# EAGLE board zx81 SD_12 (smd) (EAGLE 9.6.2), part 1 of 3
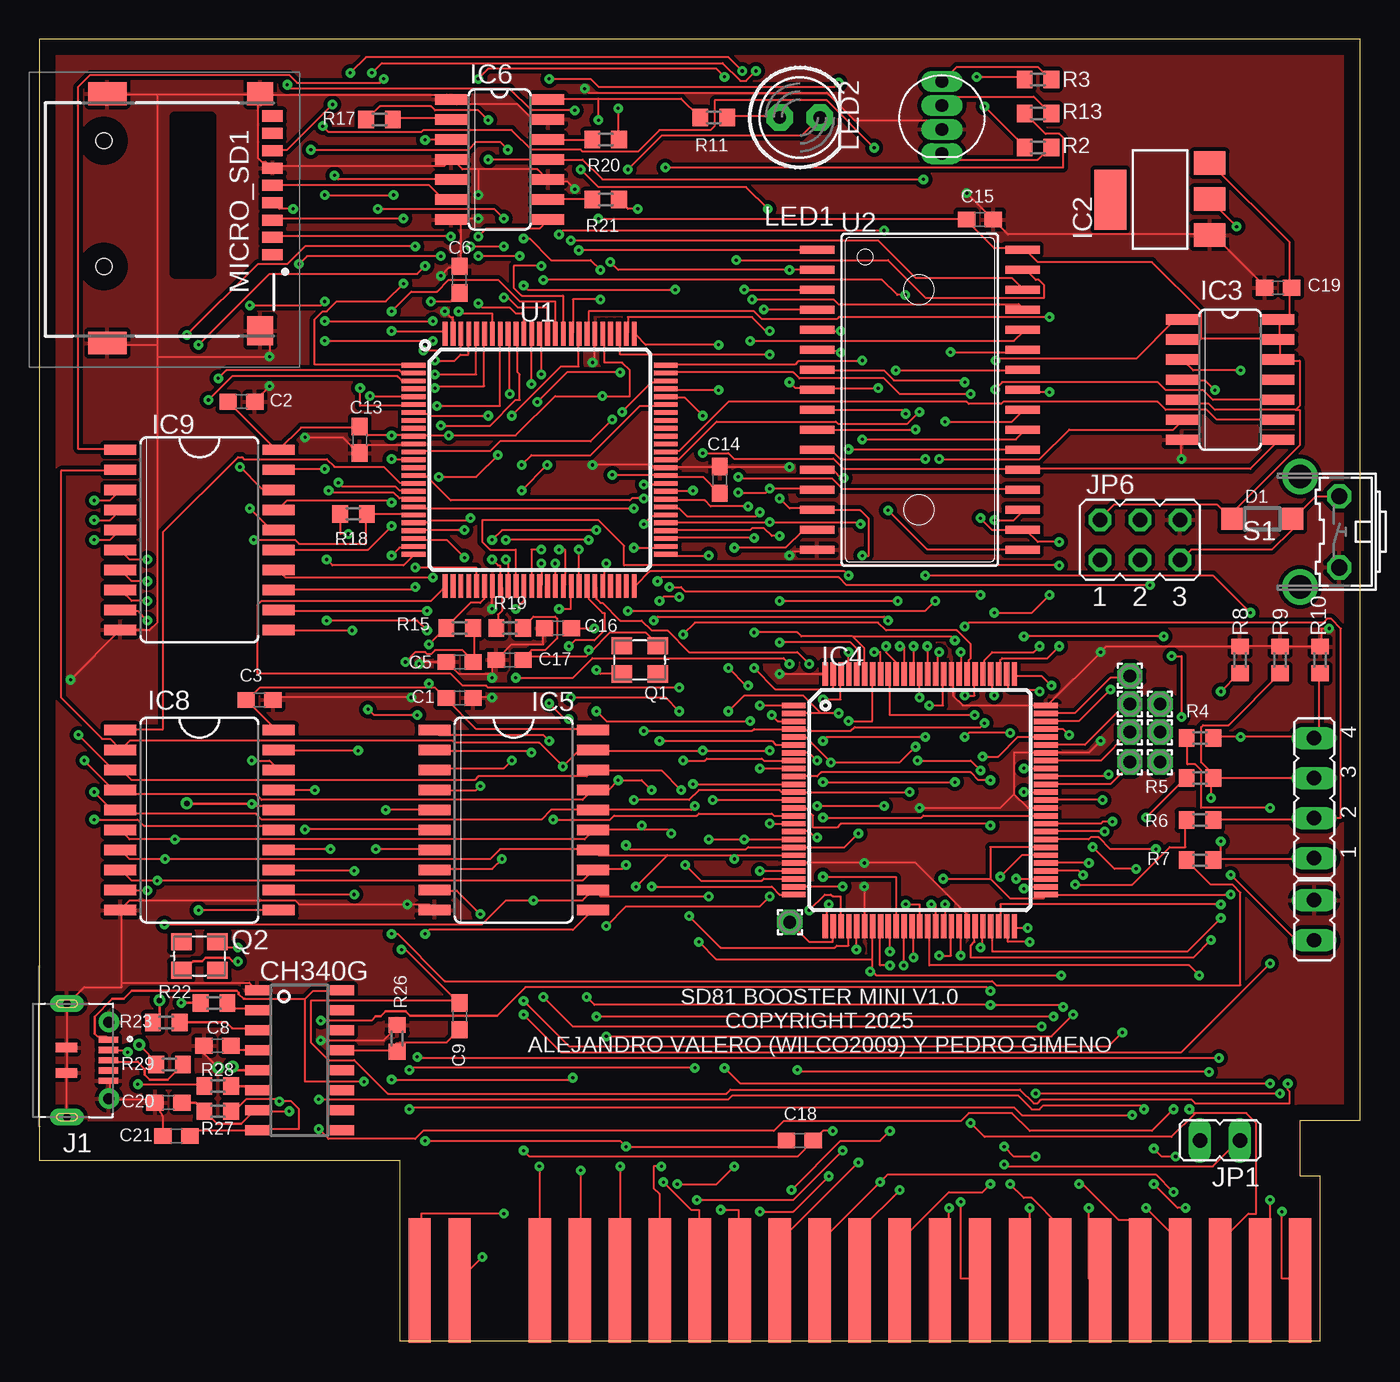
[diagram p3: board, top side]
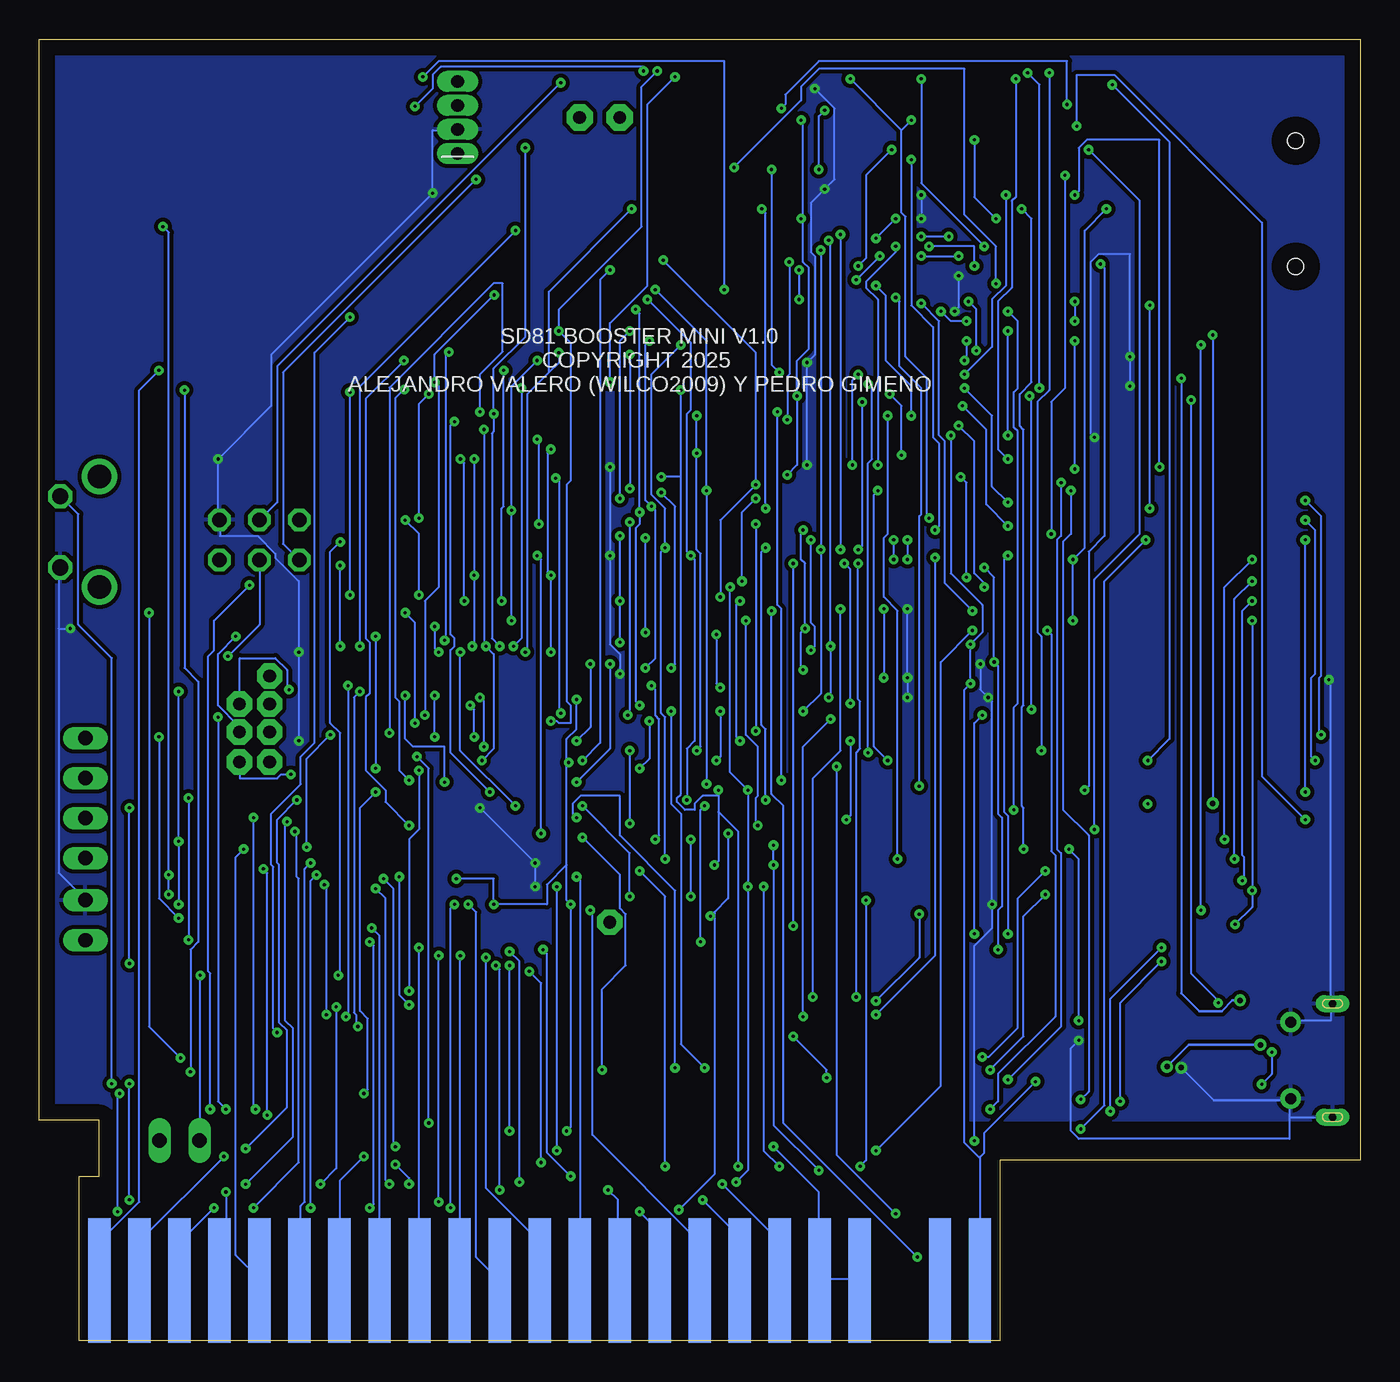
[diagram p4: board, bottom side, seen from below]

Size 83.82 x 82.55 mm. Coordinates in mm from the lower left corner, seen from the top.
Outline: 22.86,0 81.28,0 81.28,10.41 80.01,10.41 80.01,13.97 83.82,13.97 83.82,82.55 0,82.55 0,11.43 22.86,11.43 22.86,0
Copper layers (1*16): Top 0.035mm / dielectric 1.5mm / Bottom 0.035mm
Design rules "default *": minimum track width 5mil, minimum drill 0.2mm, track to track 6mil, track to pad 6mil, pad to pad 6mil, via to via 6mil, smd to smd 6mil, copper to edge 40mil, drill to drill 6mil, minimum pad ring 10mil, minimum via ring 8mil, stop-mask expansion 4mil, vias tented up to drill 999mil, thermal gap 10mil

## Footprints (pad centres in the part's own frame; a part is rotated, then mirrored left to right if it is on the bottom)
EDGEPIN = smd 1.422 x 7.874: 1 0,0
C0603 = smd 1.1 x 1: 1 -0.85,0; 2 0.85,0
SOD123 = smd 1.4 x 1.4: A 1.9,0; C -1.9,0
SOT223 = smd 1.499 x 2.007: 1 -2.261,-3.15; 2 0.025,-3.15; 3 2.311,-3.15 | smd 3.81 x 2.007: 4 0,3.15
SO14 = smd 0.66 x 2.032: 1 -3.81,-3.073; 2 -2.54,-3.073; 3 -1.27,-3.073; 4 0,-3.073; 5 1.27,-3.073; 6 2.54,-3.073; 7 3.81,-3.073; 8 3.81,3.073; 9 2.54,3.073; 10 1.27,3.073; 11 0,3.073; 12 -1.27,3.073; 13 -2.54,3.073; 14 -3.81,3.073
TQFP100 = smd 1.5 x 0.345: 1 -8,6; 2 -8,5.5; 3 -8,5; 4 -8,4.5; 5 -8,4; 6 -8,3.5; 7 -8,3; 8 -8,2.5; 9 -8,2; 10 -8,1.5; 11 -8,1; 12 -8,0.5; 13 -8,0; 14 -8,-0.5; 15 -8,-1; 16 -8,-1.5; 17 -8,-2; 18 -8,-2.5; 19 -8,-3; 20 -8,-3.5; 21 -8,-4; 22 -8,-4.5; 23 -8,-5; 24 -8,-5.5; 25 -8,-6; 51 8,-6; 52 8,-5.5; 53 8,-5; 54 8,-4.5; 55 8,-4; 56 8,-3.5; 57 8,-3; 58 8,-2.5; 59 8,-2; 60 8,-1.5; 61 8,-1; 62 8,-0.5; 63 8,0; 64 8,0.5; 65 8,1; 66 8,1.5; 67 8,2; 68 8,2.5; 69 8,3; 70 8,3.5; 71 8,4; 72 8,4.5; 73 8,5; 74 8,5.5; 75 8,6 | smd 0.345 x 1.5: 26 -6,-8; 27 -5.5,-8; 28 -5,-8; 29 -4.5,-8; 30 -4,-8; 31 -3.5,-8; 32 -3,-8; 33 -2.5,-8; 34 -2,-8; 35 -1.5,-8; 36 -1,-8; 37 -0.5,-8; 38 0,-8; 39 0.5,-8; 40 1,-8; 41 1.5,-8; 42 2,-8; 43 2.5,-8; 44 3,-8; 45 3.5,-8; 46 4,-8; 47 4.5,-8; 48 5,-8; 49 5.5,-8; 50 6,-8; 76 6,8; 77 5.5,8; 78 5,8; 79 4.5,8; 80 4,8; 81 3.5,8; 82 3,8; 83 2.5,8; 84 2,8; 85 1.5,8; 86 1,8; 87 0.5,8; 88 0,8; 89 -0.5,8; 90 -1,8; 91 -1.5,8; 92 -2,8; 93 -2.5,8; 94 -3,8; 95 -3.5,8; 96 -4,8; 97 -4.5,8; 98 -5,8; 99 -5.5,8; 100 -6,8
SO20W = smd 0.66 x 2.032: 1 -5.715,-5.029; 2 -4.445,-5.029; 3 -3.175,-5.029; 4 -1.905,-5.029; 5 -0.635,-5.029; 6 0.635,-5.029; 7 1.905,-5.029; 8 3.175,-5.029; 9 4.445,-5.029; 10 5.715,-5.029; 11 5.715,5.029; 12 4.445,5.029; 13 3.175,5.029; 14 1.905,5.029; 15 0.635,5.029; 16 -0.635,5.029; 17 -1.905,5.029; 18 -3.175,5.029; 19 -4.445,5.029; 20 -5.715,5.029
SOIC16 = smd 0.635 x 1.524: 1 -4.445,-2.695; 2 -3.175,-2.695; 3 -1.905,-2.695; 4 -0.635,-2.695; 5 0.635,-2.695; 6 1.905,-2.695; 7 3.175,-2.695; 8 4.445,-2.695; 9 4.445,2.695; 10 3.175,2.695; 11 1.905,2.695; 12 0.635,2.695; 13 -0.635,2.695; 14 -1.905,2.695; 15 -3.175,2.695; 16 -4.445,2.695
SHOUHAN_MICROXNJ = smd 0.4 x 1.25: 1 1.3,-4.375; 2 0.65,-4.375; 3 0,-4.375; 4 -0.65,-4.375; 5 -1.3,-4.375 | smd 0.6 x 1.35: S1 -0.8,-1.725; S2 0.8,-1.725 | drill 0.5 pad 1.07 long: S3 -3.6,-1.75; S6 3.6,-1.75 | drill 0.7 pad 1.3: S4 -2.425,-4.4; S5 2.425,-4.4
JP1 = drill 0.914 long: 1 0,-1.27; 2 0,1.27
JP4 = drill 0.914 long: 1 -3.81,0; 2 -1.27,0; 3 1.27,0; 4 3.81,0
JP3Q = drill 0.914 octagon: 1 -2.54,-1.27; 2 -2.54,1.27; 3 0,-1.27; 4 0,1.27; 5 2.54,-1.27; 6 2.54,1.27
LED5MM = drill 0.813 pad 1.676 octagon: A -1.27,0; K 1.27,0
LED-RGB-THRU = drill 0.813 long: 1 2.286,0; 2 0.762,0; 3 -0.762,0; 4 -2.286,0
TF-01A = smd 0.7 x 1.3: 1 2.23,7.174; 2 1.13,7.174; 3 0.03,7.174; 4 -1.07,7.174; 5 -2.17,7.174; 6 -3.27,7.174; 7 -4.37,7.174; 8 -5.47,7.174; CD1 -6.57,7.174 | smd 1.448 x 1.651: MP1 -7.989,6.4 | smd 1.448 x 2.438: MP2 -7.989,-3.3; MP3 7.836,-3.3 | smd 1.854 x 1.651: MP4 7.061,6.4 | hole 1: -5.004,-3.531; 2.972,-3.531
1,6/0,8 = drill 0.813 pad 1.6 octagon: 1 0,0
3.2X2.5_KX-7 = smd 1.3 x 1.1: 1 -1.15,-0.9; 2 1.15,-0.9; 3 1.15,0.9; 4 -1.15,0.9
R0603 = smd 1 x 1.1: 1 -0.85,0; 2 0.85,0
B3F-31XX = drill 1.016 octagon: 1 -2.261,-1.245; 2 2.261,-1.245 | drill 1.499 pad 2.159: 3 -3.505,1.245; 4 3.505,1.245
TQFP100' = smd 1.5 x 0.3: 1 -8,6; 2 -8,5.5; 3 -8,5; 4 -8,4.5; 5 -8,4; 6 -8,3.5; 7 -8,3; 8 -8,2.5; 9 -8,2; 10 -8,1.5; 11 -8,1; 12 -8,0.5; 13 -8,0; 14 -8,-0.5; 15 -8,-1; 16 -8,-1.5; 17 -8,-2; 18 -8,-2.5; 19 -8,-3; 20 -8,-3.5; 21 -8,-4; 22 -8,-4.5; 23 -8,-5; 24 -8,-5.5; 25 -8,-6; 51 8,-6; 52 8,-5.5; 53 8,-5; 54 8,-4.5; 55 8,-4; 56 8,-3.5; 57 8,-3; 58 8,-2.5; 59 8,-2; 60 8,-1.5; 61 8,-1; 62 8,-0.5; 63 8,0; 64 8,0.5; 65 8,1; 66 8,1.5; 67 8,2; 68 8,2.5; 69 8,3; 70 8,3.5; 71 8,4; 72 8,4.5; 73 8,5; 74 8,5.5; 75 8,6 | smd 0.3 x 1.5: 26 -6,-8; 27 -5.5,-8; 28 -5,-8; 29 -4.5,-8; 30 -4,-8; 31 -3.5,-8; 32 -3,-8; 33 -2.5,-8; 34 -2,-8; 35 -1.5,-8; 36 -1,-8; 37 -0.5,-8; 38 0,-8; 39 0.5,-8; 40 1,-8; 41 1.5,-8; 42 2,-8; 43 2.5,-8; 44 3,-8; 45 3.5,-8; 46 4,-8; 47 4.5,-8; 48 5,-8; 49 5.5,-8; 50 6,-8; 76 6,8; 77 5.5,8; 78 5,8; 79 4.5,8; 80 4,8; 81 3.5,8; 82 3,8; 83 2.5,8; 84 2,8; 85 1.5,8; 86 1,8; 87 0.5,8; 88 0,8; 89 -0.5,8; 90 -1,8; 91 -1.5,8; 92 -2,8; 93 -2.5,8; 94 -3,8; 95 -3.5,8; 96 -4,8; 97 -4.5,8; 98 -5,8; 99 -5.5,8; 100 -6,8
SOP32-5 = smd 2.2 x 0.5: 1 -6.516,9.525; 2 -6.516,8.255; 3 -6.516,6.985; 4 -6.516,5.715; 5 -6.516,4.445; 6 -6.516,3.175; 7 -6.516,1.905; 8 -6.516,0.635; 9 -6.516,-0.635; 10 -6.516,-1.905; 11 -6.516,-3.175; 12 -6.516,-4.445; 13 -6.516,-5.715; 14 -6.516,-6.985; 15 -6.516,-8.255; 16 -6.516,-9.525; 17 6.516,-9.525; 18 6.516,-8.255; 19 6.516,-6.985; 20 6.516,-5.715; 21 6.516,-4.445; 22 6.516,-3.175; 23 6.516,-1.905; 24 6.516,-0.635; 25 6.516,0.635; 26 6.516,1.905; 27 6.516,3.175; 28 6.516,4.445; 29 6.516,5.715; 30 6.516,6.985; 31 6.516,8.255; 32 6.516,9.525

## Placement (x,y rotation side)
1A  D7  [EDGEPIN]  24.13,3.81 0 top
1B  VCC  [EDGEPIN]  24.13,3.81 180 bottom
2A  /RAMCS  [EDGEPIN]  26.67,3.81 0 top
2B  9V  [EDGEPIN]  26.67,3.81 180 bottom
4A  D0  [EDGEPIN]  31.75,3.81 0 top
4B  GND  [EDGEPIN]  31.75,3.81 180 bottom
5A  D1  [EDGEPIN]  34.29,3.81 0 top
5B  GND  [EDGEPIN]  34.29,3.81 180 bottom
6A  D2  [EDGEPIN]  36.83,3.81 0 top
6B  /CLOCK  [EDGEPIN]  36.83,3.81 180 bottom
7A  D6  [EDGEPIN]  39.37,3.81 0 top
7B  A0  [EDGEPIN]  39.37,3.81 180 bottom
8A  D5  [EDGEPIN]  41.91,3.81 0 top
8B  A1  [EDGEPIN]  41.91,3.81 180 bottom
9A  D3  [EDGEPIN]  44.45,3.81 0 top
9B  A2  [EDGEPIN]  44.45,3.81 180 bottom
10A  D4  [EDGEPIN]  46.99,3.81 0 top
10B  A3  [EDGEPIN]  46.99,3.81 180 bottom
11A  A6  [EDGEPIN]  49.53,3.81 0 top
11B  A15  [EDGEPIN]  49.53,3.81 180 bottom
12A  /NMI  [EDGEPIN]  52.07,3.81 0 top
12B  A14  [EDGEPIN]  52.07,3.81 180 bottom
13A  /HALT  [EDGEPIN]  54.61,3.81 0 top
13B  A13  [EDGEPIN]  54.61,3.81 180 bottom
14A  /MREQ  [EDGEPIN]  57.15,3.81 0 top
14B  A12  [EDGEPIN]  57.15,3.81 180 bottom
15A  /IORQ  [EDGEPIN]  59.69,3.81 0 top
15B  A11  [EDGEPIN]  59.69,3.81 180 bottom
16A  /RD  [EDGEPIN]  62.23,3.81 0 top
16B  A10  [EDGEPIN]  62.23,3.81 180 bottom
17A  /WR  [EDGEPIN]  64.77,3.81 0 top
17B  A9  [EDGEPIN]  64.77,3.81 180 bottom
18A  /BUSAK  [EDGEPIN]  67.31,3.81 0 top
18B  A8  [EDGEPIN]  67.31,3.81 180 bottom
19A  /WAIT  [EDGEPIN]  69.85,3.81 0 top
19B  A7  [EDGEPIN]  69.85,3.81 180 bottom
20A  /BUSRQ  [EDGEPIN]  72.39,3.81 0 top
20B  A6  [EDGEPIN]  72.39,3.81 180 bottom
21A  /RESET  [EDGEPIN]  74.93,3.81 0 top
21B  A5  [EDGEPIN]  74.93,3.81 180 bottom
22A  /M1  [EDGEPIN]  77.47,3.81 0 top
22B  A4  [EDGEPIN]  77.47,3.81 180 bottom
23A  /RFSH  [EDGEPIN]  80.01,3.81 0 top
23B  /ROMCS  [EDGEPIN]  80.01,3.81 180 bottom
C1  100nF  [C0603]  26.67,40.77 0 top
C2  100nF  [C0603]  12.83,59.56 0 top
C3  100nF  [C0603]  13.97,40.64 0 top
C5  22pF  [C0603]  26.67,43.05 0 top
C6  0.1uF  [C0603]  26.67,67.31 90 top
C8  0.1uF  [C0603]  11.3,18.7 0 top
C9  100nF  [C0603]  26.67,20.57 270 top
C13  0.1uF  [C0603]  20.32,57.15 270 top
C14  0.1uF  [C0603]  43.18,54.61 90 top
C15  100nF  [C0603]  59.69,71.12 0 top
C16  22pF  [C0603]  32.91,45.19 0 top
C17  22pF  [C0603]  29.84,43.18 0 top
C18  100nF  [C0603]  48.26,12.7 180 top
C19  100nF  [C0603]  78.61,66.8 180 top
C20  22pF  [C0603]  8.19,15.1 0 top
C21  22pF  [C0603]  8.7,12.97 0 top
D1  [SOD123]  77.61,52.13 0 top
IC2  REG1117  [SOT223]  71.12,72.39 90 top
IC3  74ACT125D  [SO14]  75.56,60.96 270 top
IC4  XC95144XL-10TQG100C  [TQFP100]  55.88,34.29 0 top
IC5  74HC573D  [SO20W]  30.1,33.02 270 top
IC6  74LVC125  [SO14]  29.21,74.93 270 top
IC7  CH340G  [SOIC16]  16.51,17.78 270 top
IC8  74HC573D  [SO20W]  10.16,33.02 270 top
IC9  74HC573D  [SO20W]  10.16,50.8 270 top
J1  MICROXNJ (C404969)  [SHOUHAN_MICROXNJ]  0,17.78 90 top
JP1  MC45  [JP1]  74.93,12.7 90 top
JP2  [JP1]  80.9,26.67 0 top
JP3  JTAG  [JP4]  80.9,34.42 90 top
JP6  ICSP  [JP3Q]  69.85,50.8 0 top
LED1  SD  [LED5MM]  48.26,77.6 0 top
LED2  DIFFUSE  [LED-RGB-THRU]  57.28,77.6 270 top
MICRO_SD1  TF-01A  [TF-01A]  7.62,71.12 270 top
PAD1  [1,6/0,8]  47.62,26.54 0 top
PAD2  [1,6/0,8]  69.22,36.7 0 top
PAD3  [1,6/0,8]  71.12,36.7 0 top
PAD4  [1,6/0,8]  71.12,38.61 0 top
PAD5  [1,6/0,8]  69.22,38.61 0 top
PAD6  [1,6/0,8]  71.12,40.39 0 top
PAD7  [1,6/0,8]  69.22,40.39 0 top
PAD8  [1,6/0,8]  69.22,42.16 0 top
Q1  16MHz  [3.2X2.5_KX-7]  38.1,43.18 180 top
Q2  12MHz  [3.2X2.5_KX-7]  10.16,24.4 0 top
R2  150  [R0603]  63.37,75.69 0 top
R3  68  [R0603]  63.37,80.01 0 top
R4  180  [R0603]  73.66,38.23 0 top
R5  180  [R0603]  73.66,35.69 0 top
R6  100  [R0603]  73.66,33.02 0 top
R7  180  [R0603]  73.66,30.48 0 top
R8  330  [R0603]  76.2,43.18 270 top
R9  330  [R0603]  78.74,43.18 270 top
R10  330  [R0603]  81.28,43.18 270 top
R11  680  [R0603]  42.8,77.6 0 top
R13  150  [R0603]  63.37,77.85 0 top
R15  [R0603]  26.67,45.21 180 top
R17  3k3  [R0603]  21.59,77.47 0 top
R18  3k3  [R0603]  19.94,52.45 180 top
R19  1M  [R0603]  29.84,45.21 180 top
R20  3k3  [R0603]  35.94,76.2 0 top
R21  3k3  [R0603]  35.94,72.39 180 top
R22  1K  [R0603]  11.08,21.41 0 top
R23  1K  [R0603]  8.05,20.18 0 top
R26  1K  [R0603]  22.7,19.17 90 top
R27  1M  [R0603]  11.33,14.55 180 top
R28  22R  [R0603]  11.33,16.15 180 top
R29  22R  [R0603]  8.26,17.51 0 top
S1  [B3F-31XX]  81.25,51.31 90 top
U1  ATMEGA2560AU  [TQFP100']  31.75,55.88 0 top
U2  AS6C4008-55SINSOP5  [SOP32-5]  55.88,59.69 0 top